# EAGLE design Cobro Torniquete (EAGLE 9.1.3)
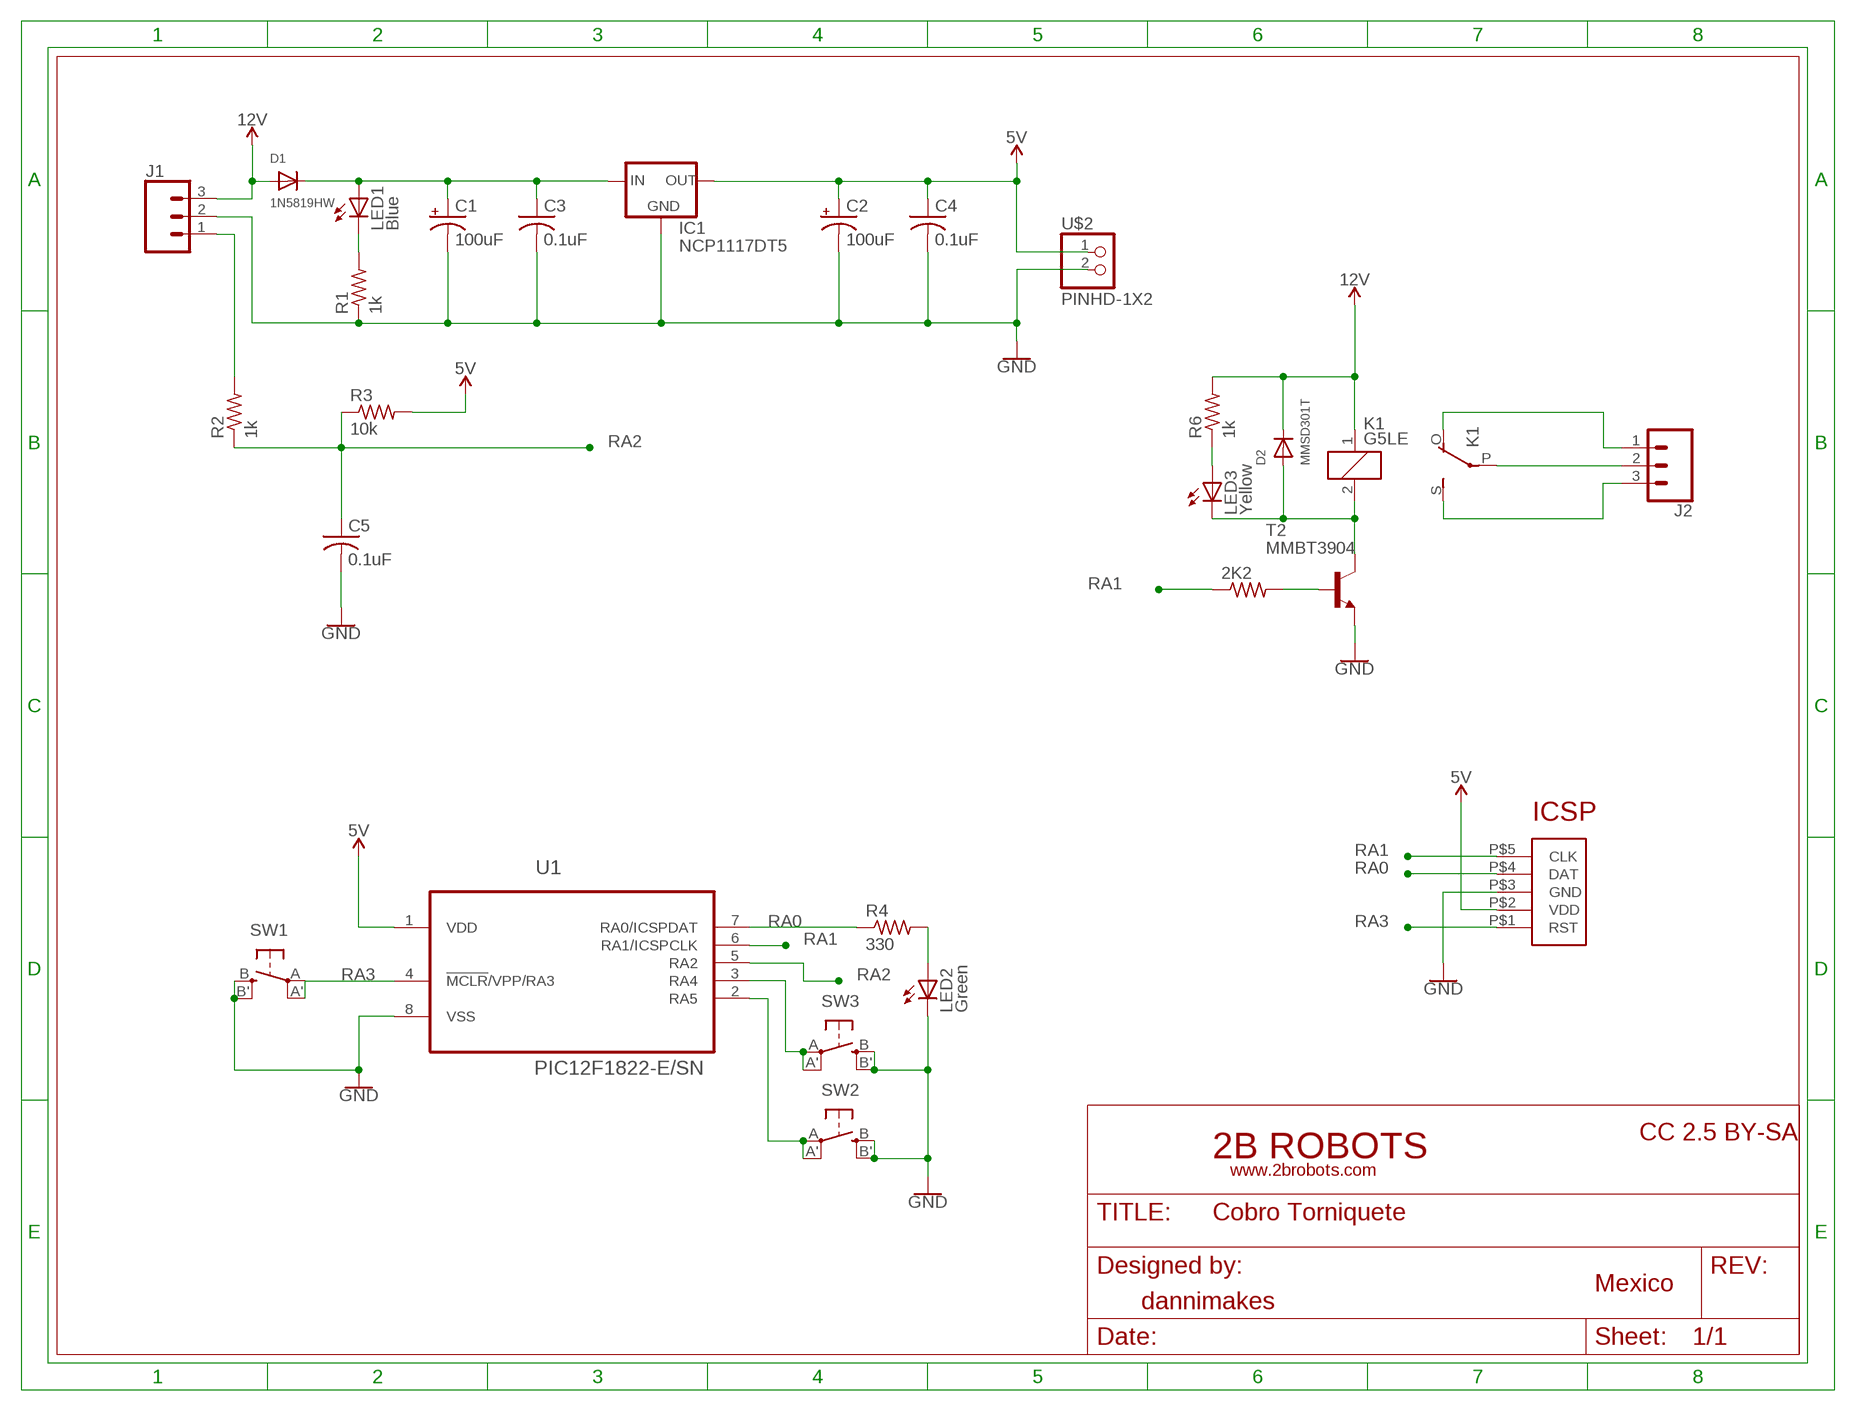
[diagram p0: schematic, sheet 1]

## Parts
2K2  R-US_R0805  [R0805]
C1  100uF  CPOL-US140CLH-0810  [140CLH-0810]
C2  100uF  CPOL-US140CLH-0810  [140CLH-0810]
C3  0.1uF  C-USC0603K  [C0603K]
C4  0.1uF  C-USC0603K  [C0603K]
C5  0.1uF  C-USC0603K  [C0603K]
D1  1N5819HW  DIODESOD-123  [SOD-123]
D2  MMSD301T  DIODESOD-123  [SOD-123]
IC1  NCP1117DT5  LM1117TO252  [TO252]
J1  CONN_03-SCREW-5MM  [SCREWTERMINAL-5MM-3]
J2  CONN_03-SCREW-5MM  [SCREWTERMINAL-5MM-3]
K1  G5LE  [G5LE]
LED1  Blue  LEDCHIPLED_1206  [CHIPLED_1206]
LED2  Green  LEDCHIPLED_1206  [CHIPLED_1206]
LED3  Yellow  LEDCHIPLED_1206  [CHIPLED_1206]
R1  1k  R-US_R0805  [R0805]
R2  1k  R-US_R0805  [R0805]
R3  10k  R-US_R0805  [R0805]
R4  330  R-US_R0805  [R0805]
R6  1k  R-US_R0805  [R0805]
SW1  SPST_TACT-EVQQ2  [EVQ-Q2]
SW2  SPST_TACT-EVQQ2  [EVQ-Q2]
SW3  SPST_TACT-EVQQ2  [EVQ-Q2]
T2  MMBT3904  MMBT3904LT1-NPN-SOT23-BEC  [SOT23-BEC]
U1  PIC12F1822-E/SN  [SOIC127P600X175-8N]
U$1  ICSP_POGO  [ICSP_POGO]
U$2  PINHD-1X2  [1X2]

## Nets
5V: C2.+ C4.1 IC1.3(OUT) R3.2 U1.1(VDD) U$1.P$2(VDD) U$2.1
12V: D1.A D2.C J1.3 K1.1 R6.2
GND: C1.- C2.- C3.2 C4.2 C5.2 IC1.1(GND) J1.2 LED2.C R1.1 SW1.B'(S1) SW1.B(S) SW2.B'(S1) SW2.B(S) SW3.B'(S1) SW3.B(S) T2.E U1.8(VSS) U$1.P$3(GND) U$2.2
N$1: C1.+ C3.1 D1.C IC1.2(IN) LED1.A
N$3: LED1.C R1.2
N$5: J2.2 K1.P(2:P)
N$6: J1.1 R2.2
N$7: J2.3 K1.S(2:S)
N$8: J2.1 K1.O(2:O)
N$9: D2.A K1.2 LED3.C T2.C
N$12: LED2.A R4.2
N$13: LED3.A R6.1
N$14: 2K2.2 T2.B
N$17: SW3.A'(P1) SW3.A(P) U1.3(RA4)
N$18: SW2.A'(P1) SW2.A(P) U1.2(RA5)
RA0: R4.1 U1.7(RA0/ICSPDAT) U$1.P$4(DAT)
RA1: 2K2.1 U1.6(RA1/ICSPCLK) U$1.P$5(CLK)
RA2: C5.1 R2.1 R3.1 U1.5(RA2)
RA3: SW1.A'(P1) SW1.A(P) U1.4(!MCLR!/VPP/RA3) U$1.P$1(RST)

## Library data of the parts
2K2 R1-R4 R6 = adafruit:R-US_: RESISTOR, American symbol
C1 C2 = adafruit:CPOL-US: POLARIZED CAPACITOR, American symbol
C3-C5 = adafruit:C-US: CAPACITOR, American symbol
D1 D2 = adafruit:DIODE: Diode SMADIODE - SMA Surface Mount Package 20V 1A Schottky Diode Digikey: 641-1014-6-ND DO-1N4148 - Through Hole Small Current Diode SOD-123 20V 1 A (.5mV Vf) Schottky Diode - Digikey: MBRX120TPMSCT-ND SOD-323 10V 570mA (.38mV Vf, 3ns) Schottky Diode - Digikey: ZLLS410CT-ND SOD-523 30V 30mA Schottky Diode (RB751S-40TE61) - Digikey: RB751S-40TE61CT-ND SOT23-R/W - SOT23 Package (R = Solder Paste/Reflow Ovens, W = Hand-Soldering) BAT54Film 40V 300mA - Digikey: 497-7162-1-ND
IC1 = v-reg-3:LM1117
J1 J2 = SparkFun-Connectors:CONN_03: Multi connection point. Often used as Generic Header-pin footprint for 0.1 inch spaced/style header connections On any of the 0.1 inch spaced packages, you can populate with these: Break Away Headers - Straight <https://www.sparkfun.com/products/116> (PRT-00116) Break Away Male Headers - Right Angle <https://www.sparkfun.com/products/553> (PRT-00553) Female Headers <https://www.sparkfun.com/products/115> (PRT-00115) Break Away Headers - Machine Pin <https://www.sparkfun.com/products/117> (PRT-00117) Break Away Female Headers - Swiss Machine Pin <https://www.sparkfun.com/products/743> (PRT-00743) Stackable Header - 3 Pin (Female, 0.1") <https://www.sparkfun.com/products/13875> (PRT-13875) For SCREWTERMINALS and SPRING TERMINALS visit here: Screw Terimnals on SparkFun.com <https://www.sparkfun.com/search/results?term=Screw+Terminals> (5mm/3.5mm/2.54mm spacing) This device is also useful as a general connection point to wire up your design to another part of your project. Our various solder wires solder well into these plated through hole pads. Hook-Up Wire - Assortment (Stranded, 22 AWG) <https://www.sparkfun.com/products/11375> (PRT-11375) Hook-Up Wire - Assortment (Solid Core, 22 AWG) <https://www.sparkfun.com/products/11367> (PRT-11367) View the entire wire category on our website here <https://www.sparkfun.com/categories/141> Special notes: Molex polarized connector foot print use with SKU : PRT-08232 with associated crimp pins and housings.; PROD_ID: CONN-10134; SF_SKU: PRT-08433
K1 = relay:G5LE: RELAY 1 x switch, 10 A/120 V AC, 8 A/30 V DC, Omron; OC_FARNELL: unknown; OC_NEWARK: unknown
LED1-LED3 = adafruit:LED: LED OSRAM: - CHIPLED LG R971, LG N971, LY N971, LG Q971, LY Q971, LO R971, LY R971 LH N974, LH R974 LS Q976, LO Q976, LY Q976 LO Q996 - Hyper CHIPLED LW Q18S LB Q993, LB Q99A, LB R99A - SideLED LS A670, LO A670, LY A670, LG A670, LP A670 LB A673, LV A673, LT A673, LW A673 LH A674 LY A675 LS A676, LA A676, LO A676, LY A676, LW A676 LS A679, LY A679, LG A679 - Hyper Micro SIDELED® LS Y876, LA Y876, LO Y876, LY Y876 LT Y87S - SmartLED LW L88C, LW L88S LB L89C, LB L89S, LG L890 LS L89K, LO L89K, LY L89K LS L896, LA L896, LO L896, LY L896 - TOPLED LS T670, LO T670, LY T670, LG T670, LP T670 LSG T670, LSP T670, LSY T670, LOP T670, LYG T670 LG T671, LOG T671, LSG T671 LB T673, LV T673, LT T673, LW T673 LH T674 LS T676, LA T676, LO T676, LY T676, LB T676, LH T676, LSB T676, LW T676 LB T67C, LV T67C, LT T67C, LS T67K, LO T67K, LY T67K, LW E67C LS E67B, LA E67B, LO E67B, LY E67B, LB E67C, LV E67C, LT E67C LW T67C LS T679, LY T679, LG T679 LS T770, LO T770, LY T770, LG T770, LP T770 LB T773, LV T773, LT T773, LW T773 LH T774 LS E675, LA E675, LY E675, LS T675 LS T776, LA T776, LO T776, LY T776, LB T776 LHGB T686 LT T68C, LB T68C - Hyper Mini TOPLED® LB M676 - Mini TOPLED Santana® LG M470 LS M47K, LO M47K, LY M47K Source: http://www.osram.convergy.de/
SW1-SW3 = adafruit:SPST_TACT: SMT 6mm switch, EVQQ2 series http://www.ladyada.net/library/eagle
T2 = transistor:*-NPN-: NPN Transistror BF959 corrected 2008.03.06
U1 = Microchip-PIC12F1822-E_SN:PIC12F1822-E/SN: 8/14-Pin Flash Microcontrollers,SOIC-8; MPN: PIC12F1822-E/SN; OC_FARNELL: 2315760; OC_NEWARK: 53R0195; PACKAGE: SOIC-8; SUPPLIER: Microchip
U$1 = ICSP_POGO:ICSP_POGO
U$2 = adafruit:PINHD-1X2

## Board
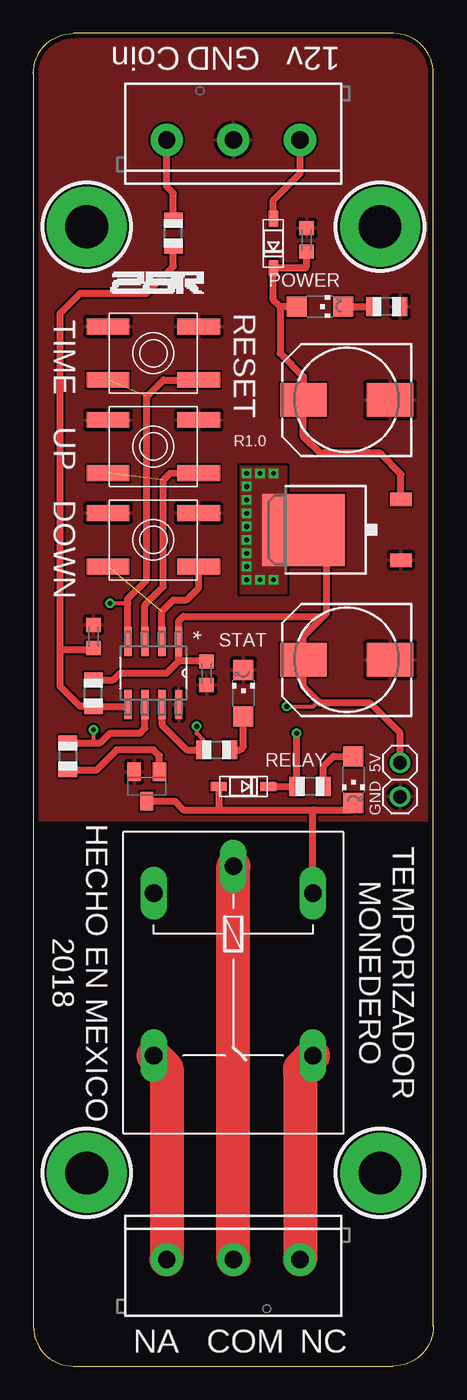
[diagram p1: board, top side]
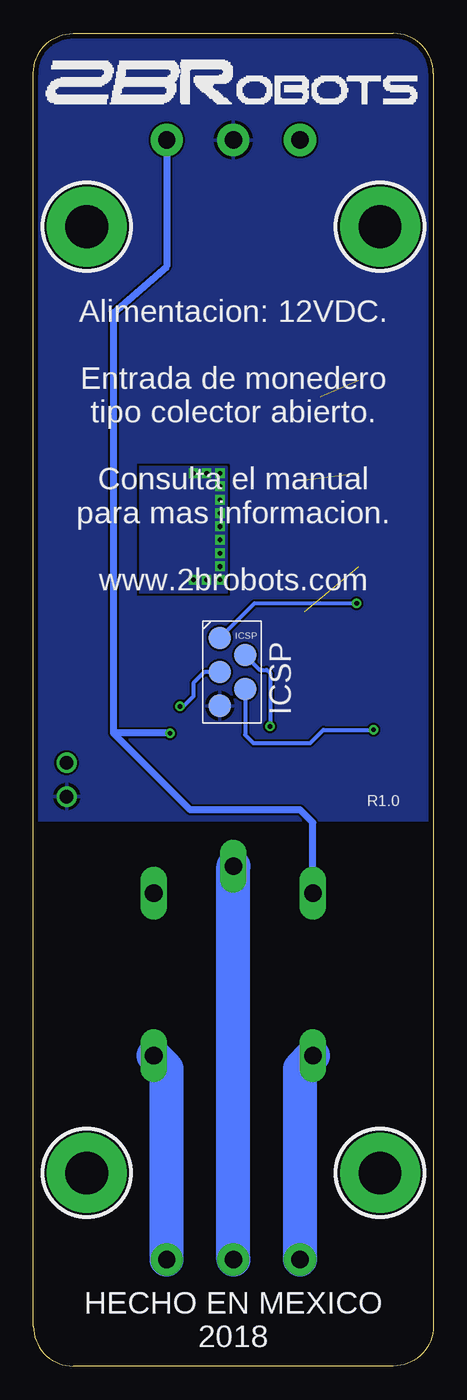
[diagram p2: board, bottom side, seen from below]

Size 30 x 100 mm. Coordinates in mm from the lower left corner, seen from the top.
Outline: 30,3 30,97 arc90 27,100 3,100 arc90 0,97 0,3 arc90 3,0 27,0 arc90 30,3
Copper layers (1*16): Top 0.0356mm / dielectric 1.5011mm / Bottom 0.0356mm
Design rules "2brobots-2layer": minimum track width 6mil, minimum drill 0.3mm, track to track 6mil, track to pad 6mil, pad to pad 6mil, via to via 6mil, smd to smd 6mil, copper to edge 15mil, drill to drill 6mil, minimum pad ring 7mil, minimum via ring 7mil, stop-mask expansion 2.5mil, vias tented up to drill 50mil, thermal gap 10mil

### Footprints (pad centres in the part's own frame; a part is rotated, then mirrored left to right if it is on the bottom)
R0805 = smd 1.1 x 1.4: 1 -1,0; 2 1,0
140CLH-0810 = smd 3.5 x 2.5: + 3.25,0; - -3.25,0
C0603K = smd 1.05 x 1.08: 1 -0.875,0; 2 0.875,0
SOD-123 = smd 1.2 x 0.7: A 1.85,0; C -1.85,0
TO252 = smd 1 x 1.6: 1 -2.28,-6.07; 2 2.28,-6.07 | smd 5.4 x 6.2: 3 0,1.23
SCREWTERMINAL-5MM-3 = drill 1.3 pad 2.413: 1 0,0; 2 5,0; 3 10,0
G5LE = drill 1.321 long: 1 -7.493,-5.969; 2 -7.493,5.969; O 4.699,5.969; P -9.525,0; S 4.699,-5.969
CHIPLED_1206 = smd 1.5 x 1.5: A 0,-1.75; C 0,1.75
EVQ-Q2 = smd 3.2 x 1.2: A -3.4,-2; A' 3.4,-2; B -3.4,2; B' 3.4,2
SOT23-BEC = smd 1 x 1.4: B -0.95,-1.1; C 0,1.1; E 0.95,-1.1
SOIC127P600X175-8N = smd 2.184 x 0.559: 1 -2.362,1.905; 2 -2.362,0.635; 3 -2.362,-0.635; 4 -2.362,-1.905; 5 2.362,-1.905; 6 2.362,-0.635; 7 2.362,0.635; 8 2.362,1.905
ICSP_POGO = smd 1.7 x 1.7: P$1 -2.55,0; P$2 0.01,0; P$3 2.54,0; P$4 -1.275,1.9; P$5 1.275,1.9
1X2 = drill 1.016: 1 -1.27,0; 2 1.27,0

### Placement (x,y rotation side)
2K2  2.58,45.76 270 top
C1  23.5,72.5 180 top
C2  23.5,53 180 top
C3  20.5,84.5 90 top
C4  13,52 270 top
C5  4.5,54.75 90 top
D1  18,84.25 90 top
D2  15.75,43.5 180 top
IC1  21.5,62.75 90 top
J1  10,92 0 top
J2  20,8 180 top
K1  15,28 270 top
LED1  21.5,79.5 270 top
LED2  15.75,50.5 0 top
LED3  24,44 180 top
R1  26.5,79.5 180 top
R2  10.5,85 90 top
R3  4.5,50.5 90 top
R4  13.75,46.25 0 top
R6  20.75,43.5 180 top
SW1  9,76 0 top
SW2  9,62 0 top
SW3  9,69 0 top
T2  8.5,43.5 180 top
U1  9,52 270 top
U$1  16.02,52.09 270 bottom
U$2  27.5,44 270 top

### Tracks (layer width: path | path; a pad name or v marks a point on that pad's centre or on a via)
5V  (via drill 0.35)
  Top 0.305: v19,49.5 21,49.5 21.38,49.88
  Top 0.508: R3.2 6,51.5 6.5,52 10,52 10.9,52.91 | 10.9,52.91 U1.1 10.9,55.91 11.25,56.25 21.75,56.25 | C4.1 12.97,52.91 10.9,52.91 | IC1.3 20.25,62.73 20.77,62.73 22,61.5 22,56.5 21.75,56.25 | U$2.1 27.5,47.5 25.25,49.75 21.5,49.75 21.38,49.88 20.25,51 C2.+ 20.25,54.75 21.75,56.25
  Bottom 0.305: U$1.P$2 17.17,52.08 18,51.25 18,50.25 18.75,49.5 v19,49.5
  other vias: 18,67 17,67 16,67 16,66 16,65 16,64 16,63 16,62 16,61 16,60 16,59 17,59 18,59
  pour Top (isolate 0.61, no thermals): 19,67.5 15.5,67.5 15.5,58 19,58
  pour Bottom (isolate 0.61): 15.5,67.5 15.5,58 22,58 22,67.5
12V  (via drill 0.35)
  Top 0.508: D1.A 18,87.5 20,89.5 J1.3 | v19.75,47.5 R6.2 D2.C
  Bottom 0.508: J1.3 20,82.5 24,79 24,47.5 | v19.75,47.5 24,47.5 | 24,47.5 18.25,41.75 10,41.75 9.03,40.78 K1.1
GND
  pour Top (isolate 0.085, rank 2): 0,100 30,100 30,41 0,41
  pour Bottom (isolate 0.085, rank 2): 0,100 30,100 30,41 0,41
N$1
  Top 0.508: LED1.A 18.5,79.5 | 18.5,79.5 18,80 D1.C 20.4,82.4 20.5,82.5 C3.1 | 18.5,79.5 18.5,76 20.25,74.25 C1.+ 20.25,69.75 21.5,68.5 26,68.5 27.57,66.93 IC1.2
N$2  (via drill 3.2 pad 6)
  other vias: 26,14.5
N$3
  Top 0.508: LED1.C R1.2
N$4  (via drill 3.2 pad 6)
  other vias: 4,85.5
N$5
  Top 2.54: J2.2 K1.P
  Bottom 2.54: J2.2 K1.P
N$6
  Top 0.508: J1.1 10,88.5 10.5,88 R2.2
N$7
  Top 2.54: K1.S 10,22.33 J2.3
  Bottom 2.54: J2.3 10,22.33 K1.S
N$8
  Top 2.54: K1.O 20,22.33 20,22 J2.1
  Bottom 2.54: J2.1 20,22.33 K1.O
N$9
  Top 0.508: 8.35,42.25 T2.C 10.6,42.4 11.25,41.75 14,41.75 | 24.28,42.03 LED3.C 24,41.75 21,41.75 | 14,41.75 21,41.75 | K1.2 20.97,41.72 21,41.75 | D2.A 13.9,41.85 14,41.75
N$10  (via drill 3.2 pad 6)
  other vias: 26,85.5
N$11  (via drill 3.2 pad 6)
  other vias: 4,14.5
N$12
  Top 0.508: R4.2 15.5,46.25 15.75,46.5 LED2.A
N$13
  Top 0.508: R6.1 21.75,45 22.5,45.75 LED3.A
N$14
  Top 0.508: 9.5,44.65 T2.B 9.45,45.8 9,46.25 6.25,46.25 4.75,44.75 2K2.2
N$17  (1 unrouted)
  Top 0.508: U1.3 8.37,57.12 9.75,58.5 9.75,66.5 10.25,67 SW3.A'
N$18  (1 unrouted)
  Top 0.508: U1.2 9.63,56.63 10.5,57.5 11.5,57.5 12.4,58.4 SW2.A'
RA0  (via drill 0.35)
  Top 0.305: v12.25,48 12.25,47.5 12.75,47 R4.1
  Top 0.508: U1.7 9.63,48.12 11.5,46.25 R4.1
  Bottom 0.305: U$1.P$4 13.01,52.25 12.5,52.25 12.25,52 v12.25,48
RA1  (via drill 0.35)
  Top 0.305: v4.5,47.75 4.5,46.76
  Top 0.508: 2K2.1 4.5,46.76 5.01,46.76 5.75,47.5 8,47.5 8.37,47.87 U1.6
  Bottom 0.305: U$1.P$5 14.12,47.37 13.5,46.75 9.25,46.75 8.25,47.75 v4.5,47.75
RA2
  Top 0.508: R2.1 10.5,82.5 8.5,80.5 3.5,80.5 2,79 2,53.75 | 4.66,49.66 R3.1 | R3.1 3.5,49.5 2,51 2,53.75 | R3.1 6.96,49.5 U1.5 | C5.1 4.38,53.75 2,53.75
RA3  (via drill 0.35)  (1 unrouted)
  Top 0.305: v5.75,57.25 7.09,57.25
  Top 0.508: U1.4 7.09,57.25 7.09,57.59 8.5,59 8.5,72.75 9.75,74 SW1.A'
  Bottom 0.305: U$1.P$1 13.41,57.25 v5.75,57.25

### Text on the board
tPlace: Coin | GND | 12v | POWER | RESET | TIME | UP | R1.0 | DOWN | STAT | RELAY | GND 5V | HECHO EN MEXICO / 2018 | TEMPORIZADOR / MONEDERO | NA | COM | NC
bPlace: Alimentacion: 12VDC. / / Entrada de monedero / tipo colector abierto. / / Consulta el manual / para mas informacion. / / www.2brobots.com | ICSP | R1.0 | HECHO EN MEXICO / 2018